# Altium project Hydroscope.PrjPcb
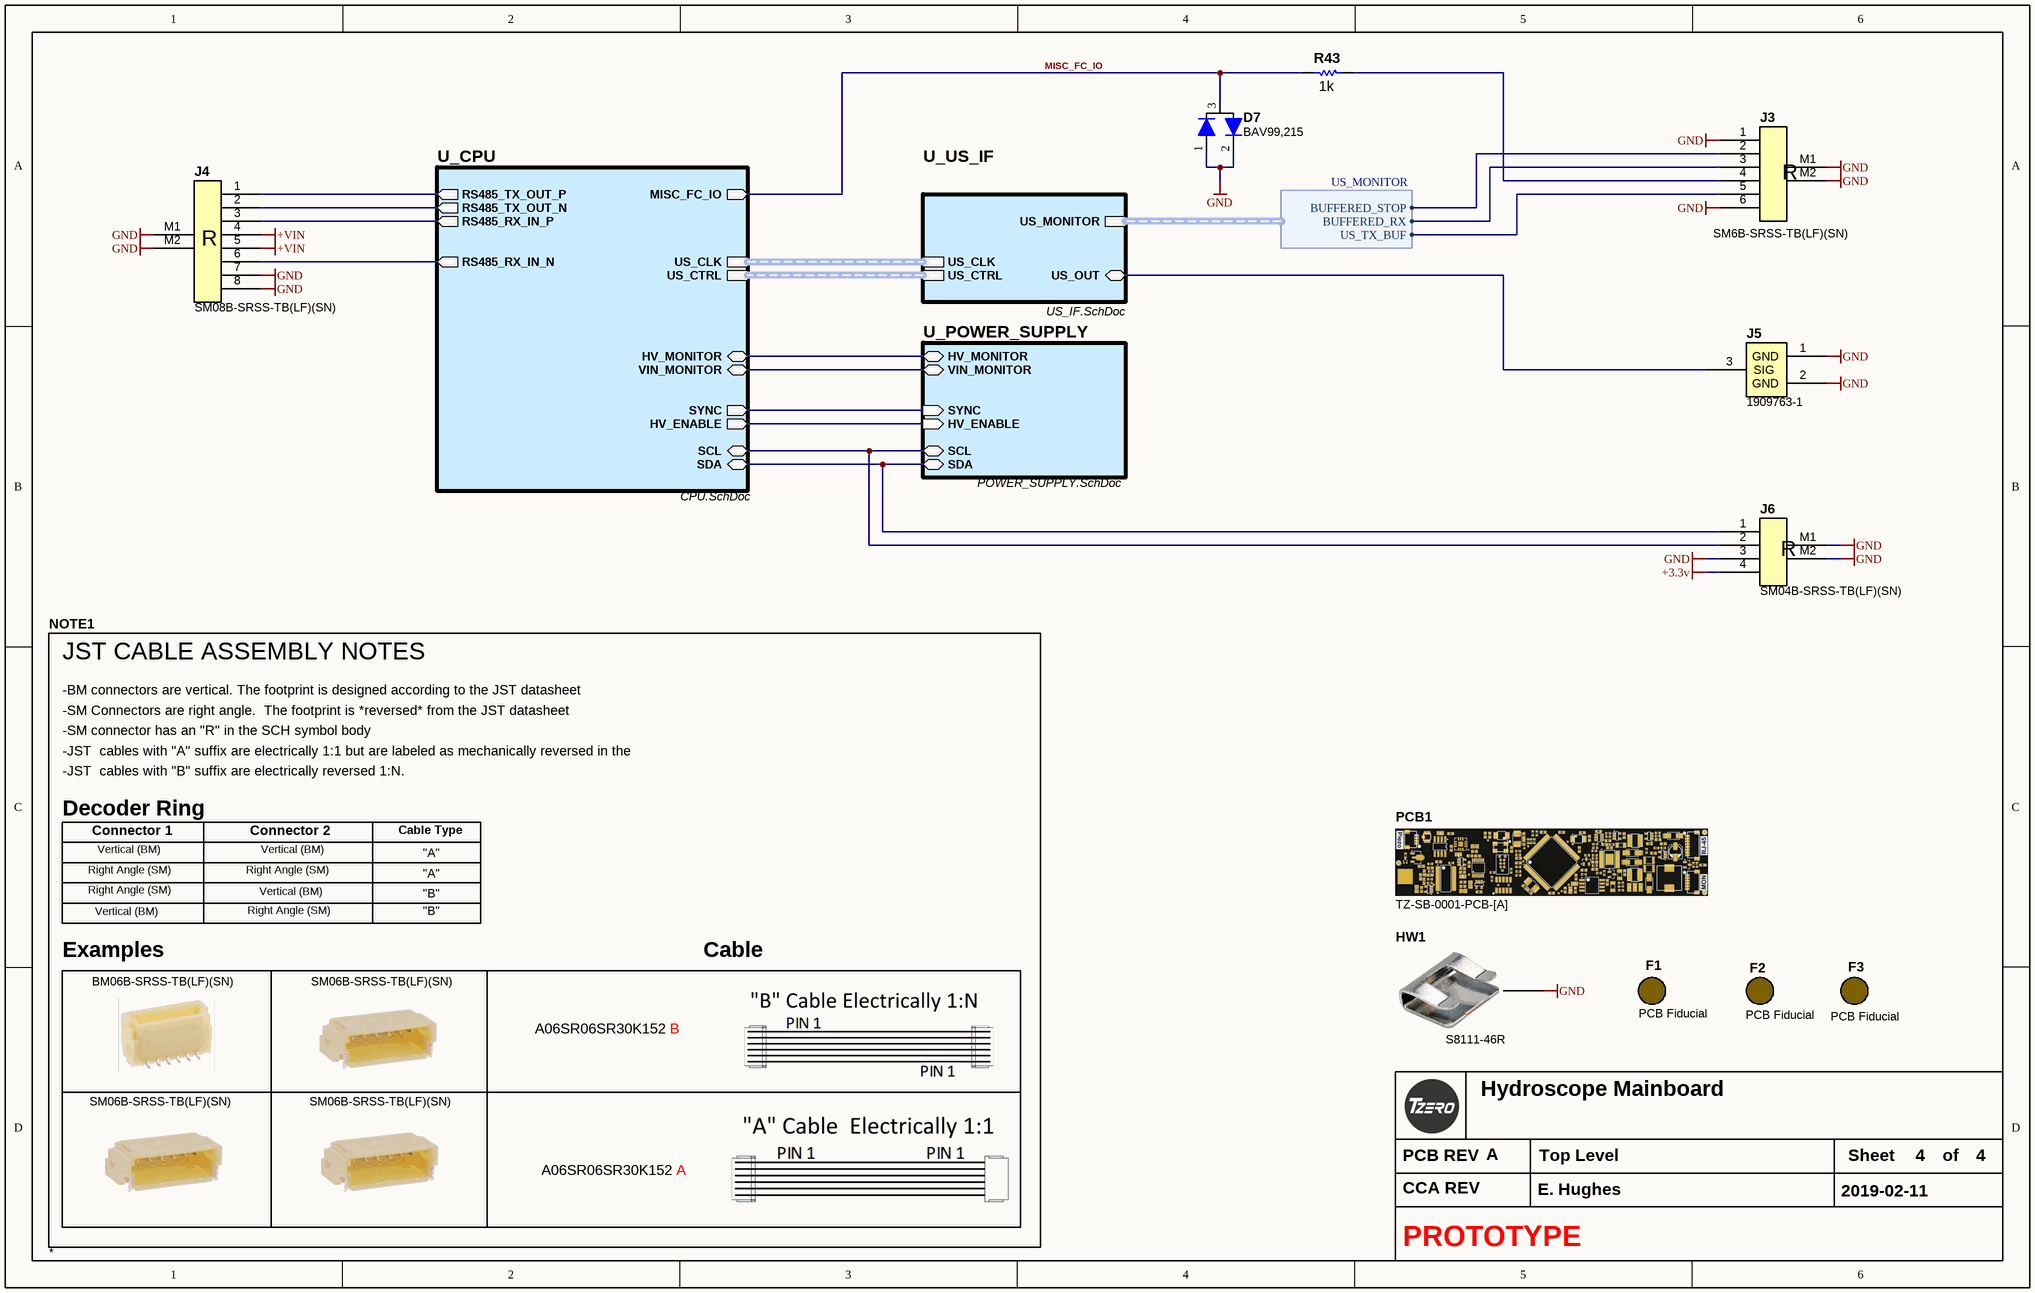
[diagram p0: TOP_LEVEL.SchDoc]
SCH_DATE: 2019-02-11; PROJECT_TITLE_LINE_1: Hydroscope Mainboard; PROJECT_STATUS: PROTOTYPE; PROJECT_ENGINEER: E. Hughes; PCB_VERSION: A; PCB_TITLE: Hydroscope Mainboard; PCB_SOLDER_MASK_COLOR_TOP: BLACK; PCB_SOLDER_MASK_COLOR_BOTTOM: BLACK; PCB_SILKSCREEN_COLOR_TOP: WHITE; PCB_SILKSCREEN_COLOR_BOTTOM: WHITE; PCB_PRINTOUT_SCALE: 1:1; PCB_PART_NUMBER: TZ-SB-0001-PCB; PCB_MIN_TRACE_WIDTH: 6mil; PCB_MIN_TRACE_SPACE: 6mil; PCB_MIN_DRILL: 10mil; PCB_MATERIAL: FR4; PCB_LAYERS: 4; PCB_FINISH_PLATING: GOLD ENIG; PCB_FINISHED_THICKNESS: 62.5mil; PCB_DRC_DATE: X; PCB_DIMENSION_Y: X; PCB_DIMENSION_X: X; PCB_COPPER_WEIGHT_OUTER: 1 oz; PCB_COPPER_WEIGHT_INNER: 1 oz; CCA_TITLE: Sonic Density Sensor Mainboard; CCA_PART_NUMBER: TZ-SB-0001; BOM_NOTES_LINE_4: -; BOM_NOTES_LINE_3: -; BOM_NOTES_LINE_2: -; BOM_NOTES_LINE_1: -; APPROVAL_REVIEWED_DATE: -; APPROVAL_REVIEWED: -; APPROVAL_ENGINEER_DATE: -; APPROVAL_ENGINEER: -; APPROVAL_DRAWN_DATE: -; APPROVAL_DRAWN: -; APPROVAL_CHECKED_DATE: -; APPROVAL_APPROVED_2_DATE: -; APPROVAL_APPROVED_2: -; APPROVAL_APPROVED_1_DATE: -; APPROVAL_APPROVED_1: -
1 sheet, 12 parts. Net scope: hierarchical (ports join the sheet entries above them; power ports are global).
Board file: TZ-SB-0001-PCB-[A] (HydroScope Mainboard).PcbDoc

## Sheet TOP_LEVEL.SchDoc
size B; DocumentNumber: 1; SheetNumber: 4; SheetTotal: 4; PAGE_TITLE: Top Level

### Parts
D7  BAV99,215  [SOT-23]
F1  PCB Fiducial  [Fiducial 1mm - 2mm]  (no BOM)
F2  PCB Fiducial  [Fiducial 1mm - 2mm]  (no BOM)
F3  PCB Fiducial  [Fiducial 1mm - 2mm]  (no BOM)
HW1  S8111-46R  [S8111-46R]
J3  SM6B-SRSS-TB(LF)(SN)  [SM06B-SRSS-TB(LF)(SN)]
J4  SM08B-SRSS-TB(LF)(SN)  [SM08B-SRSS-TB(LF)(SN)]
J5  1909763-1  [1909763-1]
J6  SM04B-SRSS-TB(LF)(SN)  [SM04B-SRSS-TB(LF)(SN)]
NOTE1  *  (graphical)
PCB1  TZ-SB-0001-PCB-[A]  (mechanical)
R43  1k  [R0603_0.55MM_HD]

### Sub-sheets
U_CPU = CPU.SchDoc (file not in this document): SDA (bidir), HV_ENABLE (out), US_CTRL (harness US_CTRL), SYNC (out), US_CLK (harness US_CLK), SCL (bidir), RS485_TX_OUT_P (out), RS485_TX_OUT_N (out), RS485_RX_IN_N (out), RS485_RX_IN_P (out), HV_MONITOR (bidir), VIN_MONITOR (bidir), MISC_FC_IO (out)
U_POWER_SUPPLY = POWER_SUPPLY.SchDoc (file not in this document): HV_ENABLE (in), SYNC (in), SCL (bidir), SDA (bidir), HV_MONITOR (bidir), VIN_MONITOR (bidir)
U_US_IF = US_IF.SchDoc (file not in this document): US_MONITOR (harness US_MONITOR), US_CLK (harness US_CLK), US_CTRL (harness US_CTRL), US_OUT (bidir)

### Harnesses
US_MONITOR: BUFFERED_STOP, BUFFERED_RX, US_TX_BUF

### Nets
+3.3v: J6.4
+VIN: J4.4 J4.5
GND: D7.1(A) D7.2(C) HW1.1 J3.1 J3.6 J3.M1 J3.M2 J4.7 J4.8 J4.M1 J4.M2 J5.1(GND) J5.2(GND) J6.3 J6.M1 J6.M2
MISC_FC_IO: D7.3(AC) R43.2 ; sheet U_CPU/MISC_FC_IO
NetJ3_2: J3.2 ; sheet U_US_IF/US_MONITOR.BUFFERED_STOP
NetJ3_3: J3.3 ; sheet U_US_IF/US_MONITOR.BUFFERED_RX
NetJ3_4: J3.4 R43.1
NetJ3_5: J3.5 ; sheet U_US_IF/US_MONITOR.US_TX_BUF
NetJ4_1: J4.1 ; sheet U_CPU/RS485_TX_OUT_P
NetJ4_2: J4.2 ; sheet U_CPU/RS485_TX_OUT_N
NetJ4_3: J4.3 ; sheet U_CPU/RS485_RX_IN_P
NetJ4_6: J4.6 ; sheet U_CPU/RS485_RX_IN_N
NetJ5_3: J5.3(SIG) ; sheet U_US_IF/US_OUT
NetJ6_1: J6.1 ; sheet U_CPU/SDA, sheet U_POWER_SUPPLY/SDA
NetJ6_2: J6.2 ; sheet U_CPU/SCL, sheet U_POWER_SUPPLY/SCL
(unnamed): sheet U_CPU/HV_ENABLE, sheet U_POWER_SUPPLY/HV_ENABLE
(unnamed): sheet U_CPU/SYNC, sheet U_POWER_SUPPLY/SYNC
(unnamed): sheet U_CPU/HV_MONITOR, sheet U_POWER_SUPPLY/HV_MONITOR
(unnamed): sheet U_CPU/VIN_MONITOR, sheet U_POWER_SUPPLY/VIN_MONITOR

### Buses and harness runs
harness sheet U_CPU/US_CLK = sheet U_US_IF/US_CLK
harness sheet U_CPU/US_CTRL = sheet U_US_IF/US_CTRL

### Notes on the sheet
- PCB REV
- Sheet
- of
- CCA REV
- (in symbol JST_SH_CABLE_ASSEMBLY_NOTES) JST CABLE ASSEMBLY NOTES; -BM connectors are vertical. The footprint is designed according to the JST datasheet; -SM Connectors are right angle.  The footprint is *reversed* from the JST datasheet; -SM connector has an "R" in the SCH symbol body; -JST  cables with "A" suffix are electrically 1:1 but are labeled as mechanically reversed in the; -JST  cables with "B" suffix are electrically reversed 1:N.; Decoder Ring; Cable Type; Connector 1; Connector 2; Vertical (BM); "A"; Right Angle (SM); "B"; Examples; Cable; BM06B-SRSS-TB(LF)(SN); SM06B-SRSS-TB(LF)(SN); A06SR06SR30K152; B; A
- (in symbol SM04B-SRSS-TB(LF)(SN)) R
- (in symbol SM06B-SRSS-TB(LF)(SN)) R
- (in symbol SM08B-SRSS-TB(LF)(SN)) R

### Library data of the parts
D7 = BAV99,215: DIODE ARRAY GP 100V 215MA SOT23; Manufacturer: NXP Semiconductors; Peak Non-Repetitive Surge Current: 4A; Reverse Recovery Time: 4ns; Peak Reverse Current: 500nA; Forward Voltage: 1.25V; Power Dissipation: 250mW; Max Power Dissipation: 250W; Breakdown Voltage: 75V; Supplier 1: Digi-Key; Supplier Part Number 1: 954-BAV99215-CHP; Manufacturer Part Number: BAV99,215; Stock 1: 0; Mount: Surface Mount; Case/Package: TO-236-3; Number of Pins: 3; Weight: 0.01lb; Contact Plating: Tin,Matte; Min Operating Temperature: -65°C; Max Operating Temperature: 150°C; Packaging: Tape and Reel; Forward Current: 215mA; Max Repetitive Reverse Voltage (Vrrm): 100V; Max Surge Current: 4A; Package Quantity: 1; Recovery Time: 4ns; Average Rectified Current: 215mA; Max Forward Surge Current (Ifsm): 4A; Termination: SMD/SMT; Voltage: 100V; Max Reverse Voltage (DC): 100V; Length: 0.25inch; Height: 0.25inch; Width: 0.25inch; Lead Free: Lead Free; REACH SVHC: No SVHC; ComponentLink1URL: https://datasheet.ciiva.com/33728/953882-33728752.pdf; ComponentLink1Description: https://datasheet.ciiva.com/33728/953882-33728752.pdf; ComponentLink2URL: https://datasheet.ciiva.com/904/bav99-ser-904513.pdf; ComponentLink2Description: https://datasheet.ciiva.com/904/bav99-ser-904513.pdf; ComponentLink3URL: https://datasheet.ciiva.com/4434/bav99-ser-4434805.pdf; ComponentLink3Description: https://datasheet.ciiva.com/4434/bav99-ser-4434805.pdf; ComponentLink4URL: https://datasheet.ciiva.com/16474/bav99-ser-16474903.pdf; ComponentLink4Description: https://datasheet.ciiva.com/16474/bav99-ser-16474903.pdf; ComponentLink5URL: https://datasheet.ciiva.com/22628/953882-22628007.pdf; ComponentLink5Description: https://datasheet.ciiva.com/22628/953882-22628007.pdf; ComponentLink6URL: https://datasheet.ciiva.com/36858/953882-36858552.pdf; ComponentLink6Description: https://datasheet.ciiva.com/36858/953882-36858552.pdf; ComponentLink7URL: https://datasheet.ciiva.com/904/bav99-ser-904509.pdf; ComponentLink7Description: https://datasheet.ciiva.com/904/bav99-ser-904509.pdf; ComponentLink8URL: https://datasheet.ciiva.com/904/bav99-ser-904511.pdf; ComponentLink8Description: https://datasheet.ciiva.com/904/bav99-ser-904511.pdf; Value: BAV99,215
F1-F3 = Fiducial: Value: PCB Fiducial
HW1 = S8111-46R: CBL CLIP 1-1.5MM DIA CBL SMD; Manufacturer: Harwin; Wire/Cable Colour: Grey; Material Thickness: 0.008inch; Value: S8111-46R; Supplier 1: Digi-Key; Supplier Part Number 1: 952-1577-1-ND; Manufacturer Part Number: S8111-46R; Stock 1: 36199; Pricing 1: 1=0.27, 10=0.254, 25=0.218, 50=0.1852, 100=0.1779, 250=0.15972, 500=0.15246 (USD); Mount: Solder; Colour: Natural,Silver; Material: Bronze,Copper,Tin; Package Quantity: 1500; Packaging: Tape and Reel; Length: 5mm; Height: 0.081inch; Width: 5mm; Depth: 5mm; REACH SVHC: No SVHC; ComponentLink1URL: https://datasheet.ciiva.com/73/s8111r-73504.pdf; ComponentLink1Description: https://datasheet.ciiva.com/73/s8111r-73504.pdf; ComponentLink2URL: https://datasheet.ciiva.com/5230/s8111r-65574-5230384.pdf; ComponentLink2Description: https://datasheet.ciiva.com/5230/s8111r-65574-5230384.pdf; ComponentLink3URL: https://datasheet.ciiva.com/73/s8111r-73505.pdf; ComponentLink3Description: https://datasheet.ciiva.com/73/s8111r-73505.pdf; ComponentLink4URL: https://datasheet.ciiva.com/1515/1694708-1515016.pdf; ComponentLink4Description: https://datasheet.ciiva.com/1515/1694708-1515016.pdf; ComponentLink5URL: https://datasheet.ciiva.com/30474/0900766b81270b7b-30474510.pdf; ComponentLink5Description: https://datasheet.ciiva.com/30474/0900766b81270b7b-30474510.pdf; Orientation: Straight; Radiation Hardening: No
J3 = SM06B-SRSS-TB(LF)(SN): 6 Positions Header, Shrouded Connector 0.039" (1.00mm) Surface Mount, Right Angle Tin; Manufacturer: JST; Number of Positions: 6; Connector Type: Male Pin; Current Rating: 1A; Voltage Rating: 50V; Contact Resistance: 40mR; Insulation Resistance: 100MR; Gender: Male; Pitch: 1mm; Value: SM6B-SRSS-TB(LF)(SN); Supplier 1: Digi-Key; Supplier Part Number 1: 455-1806-1-ND; Manufacturer Part Number: SM06B-SRSS-TB(LF)(SN); Stock 1: 40560; Pricing 1: 1=0.83, 10=0.782, 100=0.5996, 500=0.5214, 1000=0.4301 (USD); Mount: Surface Mount; Contact Material: Copper,Copper Alloy; Contact Plating: Copper,Tin,Lead; Colour: Natural; Housing Colour: Beige; Housing Material: Polyamide; Material: Polyamide; Min Operating Temperature: -25°C; Max Operating Temperature: 85°C; Number of Rows: 1; Packaging: Tape and Reel; Termination: Solder; Number of Contacts: 6; Orientation: Right Angle; Voltage Rating (AC): 50V; Max Current Rating: 1A; Max Voltage Rating (AC): 50V; Max Voltage Rating (DC): 50V; Length: 8mm; Lead Pitch: 1mm; Depth: 4.95mm; Lead Free: Lead Free; REACH SVHC: No SVHC; Flammability Rating: UL94 V-0; ComponentLink1URL: https://datasheet.ciiva.com/11752/0900766b8082f544-11752176.pdf; ComponentLink1Description: https://datasheet.ciiva.com/11752/0900766b8082f544-11752176.pdf; ComponentLink2URL: https://datasheet.ciiva.com/16217/sm06b-srss-tblfsn-16217552.pdf; ComponentLink2Description: https://datasheet.ciiva.com/16217/sm06b-srss-tblfsn-16217552.pdf; ComponentLink3URL: https://datasheet.ciiva.com/26894/getdatasheetpartid-490708-26894951.pdf; ComponentLink3Description: https://datasheet.ciiva.com/26894/getdatasheetpartid-490708-26894951.pdf; ComponentLink4URL: https://datasheet.ciiva.com/26894/getdatasheetpartid-639890-26894680.pdf; ComponentLink4Description: https://datasheet.ciiva.com/26894/getdatasheetpartid-639890-26894680.pdf; ComponentLink5URL: https://datasheet.ciiva.com/8052/91630-8052281.pdf; ComponentLink5Description: https://datasheet.ciiva.com/8052/91630-8052281.pdf; ComponentLink6URL: https://datasheet.ciiva.com/712/esr-712571.pdf; ComponentLink6Description: https://datasheet.ciiva.com/712/esr-712571.pdf; ComponentLink7URL: https://datasheet.ciiva.com/712/esr-712572.pdf; ComponentLink7Description: https://datasheet.ciiva.com/712/esr-712572.pdf; ComponentLink8URL: https://datasheet.ciiva.com/730/esr-730671.pdf; ComponentLink8Description: https://datasheet.ciiva.com/730/esr-730671.pdf
J4 = SM08B-SRSS-TB(LF)(SN): 8 Positions Header, Shrouded Connector 0.039" (1.00mm) Surface Mount, Right Angle Tin; Manufacturer: JST; Number of Positions: 8; Connector Type: Male Pin; Contact Resistance: 20mR; Current Rating: 1A; Voltage Rating (AC): 50V; Insulation Resistance: 100MR; Gender: Male; Pitch: 0.039inch; Value: SM08B-SRSS-TB(LF)(SN); Supplier 1: Digi-Key; Manufacturer Part Number: SM08B-SRSS-TB(LF)(SN); Stock 1: 51779; Pricing 1: 1=0.9, 10=0.793, 100=0.6838, 500=0.55948, 1000=0.49731 (USD); Mount: Surface Mount; Colour: Natural; Contact Plating: Tin,Lead; Contact Material: Copper,Copper Alloy; Housing Colour: Natural; Housing Material: Nylon; Material: Polyamide; Min Operating Temperature: -25°C; Max Operating Temperature: 85°C; Packaging: Tape and Reel; Number of Rows: 1; Termination: Solder; Number of Contacts: 8; Orientation: Right Angle; Voltage Rating: 50V; Lead Pitch: 1mm; Lead Free: Lead Free; REACH SVHC: No SVHC; Flammability Rating: UL94 V-0; ComponentLink1URL: https://datasheet.ciiva.com/712/esr-712599.pdf; ComponentLink1Description: https://datasheet.ciiva.com/712/esr-712599.pdf; ComponentLink2URL: https://datasheet.ciiva.com/712/esr-712600.pdf; ComponentLink2Description: https://datasheet.ciiva.com/712/esr-712600.pdf; ComponentLink3URL: https://datasheet.ciiva.com/8052/91630-8052285.pdf; ComponentLink3Description: https://datasheet.ciiva.com/8052/91630-8052285.pdf; ComponentLink4URL: https://datasheet.ciiva.com/729/esr-729838.pdf; ComponentLink4Description: https://datasheet.ciiva.com/729/esr-729838.pdf; ComponentLink5URL: https://datasheet.ciiva.com/11752/0900766b8082f54b-11752174.pdf; ComponentLink5Description: https://datasheet.ciiva.com/11752/0900766b8082f54b-11752174.pdf; ComponentLink6URL: https://datasheet.ciiva.com/16487/esr-16487087.pdf; ComponentLink6Description: https://datasheet.ciiva.com/16487/esr-16487087.pdf; Supplier Part Number 1: 455-1808-1-ND
J5 = 1909763-1: CONN UMCC JACK STR 50OHM SMD; Manufacturer: TE Connectivity AMP Connectors; Connector Style: Ultra Miniature Coaxial; Connector Type: Jack, Male Pin; Contact Termination: Solder; Body Material: Copper Alloy; Body Finish: Gold; Dielectric Material: Liquid Crystal Polymer (LCP); Voltage Rating: 60V; Mating Cycles: 30; Insertion Loss: 0.24dB; Value: 1909763-1; Supplier 1: Digi-Key; Supplier Part Number 1: A118077CT-ND; Manufacturer Part Number: 1909763-1; RoHS: RoHS Compliant; Category: Connectors, Interconnects; Stock 1: 75031; Pricing 1: 1=0.49, 10=0.462, 25=0.416, 50=0.3696, 100=0.3542, 250=0.3234, 500=0.308, 1000=0.2541, 2500=0.231 (USD); Packaging: Cut Tape (CT); Part Status: Active; Shield Termination: Solder; Impedance: 50 Ohm; Mounting Type: Surface Mount; Mounting Feature: -; Cable Group: -; Fastening Type: Snap-On; Features: -; Housing Color: Ivory; Ingress Protection: -; Includes: -; Center Contact Plating: Gold; Operating Temperature: -40°C ~ 90°C; Center Contact Material: Copper Alloy; ComponentLink1URL: http://www.te.com/commerce/DocumentDelivery/DDEController?Action=srchrtrv&DocNm=1909763&DocType=Customer+Drawing&DocLang=English; ComponentLink1Description: http://www.te.com/commerce/DocumentDelivery/DDEController?Action=srchrtrv&DocNm=1909763&DocType=Customer+Drawing&DocLang=English
J6 = SM04B-SRSS-TB(LF)(SN): Conn Shrouded Header HDR 4 POS 1mm Solder RA SMD T/R; Manufacturer: JST; Number of Positions: 4; Connector Type: Male Pin; Contact Resistance: 40mR; Max Current Rating: 1A; Max Voltage Rating (AC): 50V; Pitch: 0.039inch; Value: SM04B-SRSS-TB(LF)(SN); Supplier 1: Digi-Key; Manufacturer Part Number: SM04B-SRSS-TB(LF)(SN); Stock 1: 43886; Pricing 1: 1=0.61, 10=0.569, 100=0.436, 500=0.37914, 1000=0.31279 (USD); Mount: Surface Mount; Contact Material: Copper Alloy; Contact Plating: Copper,Tin; Colour: Natural; Housing Colour: Beige; Housing Material: Polyamide; Min Operating Temperature: -25°C; Max Operating Temperature: 85°C; Number of Rows: 1; Termination: Solder; Packaging: Tape and Reel; Orientation: Right Angle; Number of Contacts: 4; Max Voltage Rating (DC): 50V; Length: 6mm; Depth: 4.95mm; Lead Free: Lead Free; ComponentLink1URL: https://datasheet.ciiva.com/26894/getdatasheetpartid-499363-26894945.pdf; ComponentLink1Description: https://datasheet.ciiva.com/26894/getdatasheetpartid-499363-26894945.pdf; ComponentLink2URL: https://datasheet.ciiva.com/26894/getdatasheetpartid-640736-26894676.pdf; ComponentLink2Description: https://datasheet.ciiva.com/26894/getdatasheetpartid-640736-26894676.pdf; ComponentLink3URL: https://datasheet.ciiva.com/16487/jstsm04b-srss-tb-lf-sn-16487222.pdf; ComponentLink3Description: https://datasheet.ciiva.com/16487/jstsm04b-srss-tb-lf-sn-16487222.pdf; Supplier Part Number 1: 455-1804-1-ND
NOTE1 = JST_SH_CABLE_ASSEMBLY_NOTES: Value: *
PCB1 = TZ-SB-0001-PCB-[A]: Raw printed circuit board,  Revision A; Manufacturer: TZero; Value: TZ-SB-0001-PCB-[A]; Manufacturer Part Number: TZ-SB-0001-PCB-[A]
R43 = ERJ-3EKF1001V: RES 1K OHM 1/10W 1% 0603 SMD; Manufacturer: Panasonic Electronic Components; Package Power: 0603  (0.1W); Power (Watts): 0.1W- 1/10W; Temperature Coefficient: ±100ppm/°C; Limiting Element Voltage: 75; Maximum Overload Voltage: 150; Maximum Working Voltage: 10.0V; Substitution Notes: 1k , ±1% , 0603 , AEC-Q200; Value: 1k; Manufacturer Part Number: ERJ-3EKF1001V; ComponentLink1Description: Internal Datasheet; ComponentLink1URL: datasheets\Panasonic Electronic Components\AOA0000CE2.pdf; ComponentLink2Description: External Datasheet; ComponentLink2URL: http://industrial.panasonic.com/www-data/pdf/AOA0000/AOA0000CE2.pdf; Supplier 1: Digi-Key; Supplier Part Number 1: P1.00KHCT-ND; Category: Resistors; Resistance (Ohms): 1k; Composition: Thick Film; Features: -; Tolerance: ±1%; Package: 0603 (1608 Metric); Supplier Package: 0603; Size / Dimension: 0.063" L x 0.031" W (1.60mm x 0.80mm); Height: 0.55MM; Number of Terminations: 2; Packaging: Cut Tape (CT); Sort Value: 1000; Sort Value Package: 603_1000; Ratings: AEC-Q200

## Assembly variants
A: not fitted J6
B: all parts fitted